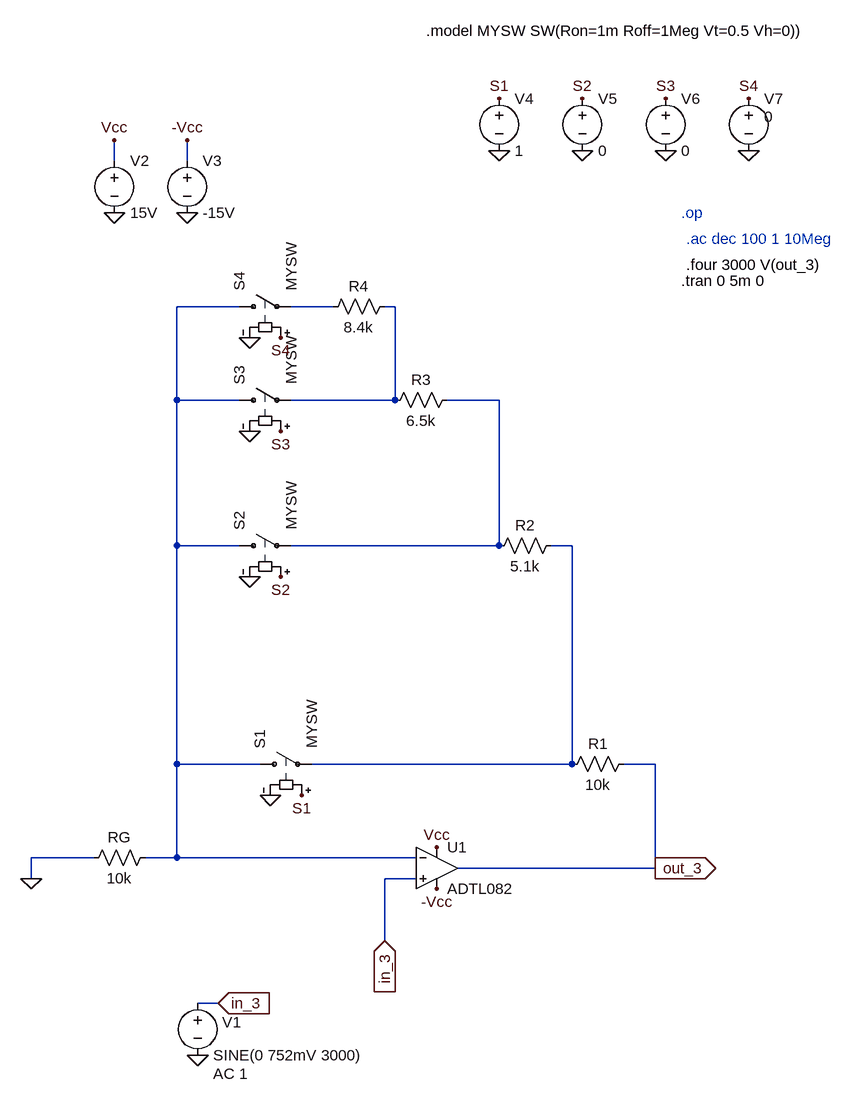
[diagram p0: schematic etaj3.asc]
etaj3.asc, the LTspice schematic file:
Version 4
SHEET 1 1004 1260
WIRE -544 -160 -544 -192
WIRE -432 -160 -432 -192
WIRE -352 64 -448 64
WIRE -208 64 -272 64
WIRE -112 64 -128 64
WIRE -448 208 -448 64
WIRE -352 208 -448 208
WIRE -112 208 -112 64
WIRE -112 208 -272 208
WIRE 48 208 -32 208
WIRE -448 432 -448 208
WIRE -352 432 -448 432
WIRE 48 432 48 208
WIRE 48 432 -272 432
WIRE 160 432 128 432
WIRE -448 768 -448 432
WIRE -320 768 -448 768
WIRE 160 768 160 432
WIRE 160 768 -240 768
WIRE 288 768 240 768
WIRE -576 912 -672 912
WIRE -448 912 -448 768
WIRE -448 912 -496 912
WIRE -80 912 -448 912
WIRE 288 928 288 768
WIRE 288 928 -16 928
WIRE -672 944 -672 912
WIRE -80 944 -128 944
WIRE -128 1040 -128 944
WIRE -384 1136 -416 1136
FLAG -432 -80 0
FLAG -544 -80 0
FLAG -544 -192 Vcc
FLAG -432 -192 -Vcc
FLAG -48 896 Vcc
FLAG -48 960 -Vcc
FLAG -672 944 0
FLAG -416 1216 0
FLAG 48 -176 0
FLAG 48 -256 S1
FLAG 176 -176 0
FLAG 176 -256 S2
FLAG 304 -176 0
FLAG 304 -256 S3
FLAG 432 -176 0
FLAG 432 -256 S4
FLAG -304 816 0
FLAG -336 480 0
FLAG -336 256 0
FLAG -336 112 0
FLAG -288 112 S4
FLAG -288 256 S3
FLAG -288 480 S2
FLAG -256 816 S1
FLAG 288 928 out_3
IOPIN 288 928 Out
FLAG -128 1040 in_3
IOPIN -128 1040 In
FLAG -384 1136 in_3
IOPIN -384 1136 In
SYMBOL voltage -416 1120 R0
WINDOW 0 38 45 Left 2
WINDOW 123 24 124 Left 2
WINDOW 39 0 0 Left 0
SYMATTR InstName V1
SYMATTR Value2 AC 1
SYMATTR Value SINE(0 752mV 3000)
SYMBOL OpAmps\\ADTL082 -48 864 R0
SYMATTR InstName U1
SYMBOL voltage -544 -176 R0
WINDOW 123 0 0 Left 2
WINDOW 39 0 0 Left 2
SYMATTR InstName V2
SYMATTR Value 15V
SYMBOL voltage -432 -176 R0
WINDOW 123 0 0 Left 2
WINDOW 39 0 0 Left 2
SYMATTR InstName V3
SYMATTR Value -15V
SYMBOL res -480 896 R90
WINDOW 0 0 56 VBottom 2
WINDOW 3 32 56 VTop 2
SYMATTR InstName RG
SYMATTR Value 10k
SYMBOL res 256 752 R90
WINDOW 0 0 56 VBottom 2
WINDOW 3 32 56 VTop 2
SYMATTR InstName R1
SYMATTR Value 10k
SYMBOL res 144 416 R90
WINDOW 0 0 56 VBottom 2
WINDOW 3 32 56 VTop 2
SYMATTR InstName R2
SYMATTR Value 5.1k
SYMBOL res -16 192 R90
WINDOW 0 0 56 VBottom 2
WINDOW 3 32 56 VTop 2
SYMATTR InstName R3
SYMATTR Value 6.5k
SYMBOL res -112 48 R90
WINDOW 0 0 56 VBottom 2
WINDOW 3 32 56 VTop 2
SYMATTR InstName R4
SYMATTR Value 8.4k
SYMBOL voltage 48 -272 R0
WINDOW 123 0 0 Left 0
WINDOW 39 0 0 Left 0
SYMATTR InstName V4
SYMATTR Value 1
SYMBOL voltage 176 -272 R0
WINDOW 123 0 0 Left 0
WINDOW 39 0 0 Left 0
SYMATTR InstName V5
SYMATTR Value 0
SYMBOL voltage 304 -272 R0
WINDOW 123 0 0 Left 0
WINDOW 39 0 0 Left 0
SYMATTR InstName V6
SYMATTR Value 0
SYMBOL voltage 432 -272 R0
WINDOW 123 0 0 Left 0
WINDOW 39 0 0 Left 0
WINDOW 3 24 44 Left 2
SYMATTR InstName V7
SYMATTR Value 0
SYMBOL sw -336 768 R270
SYMATTR InstName S1
SYMATTR Value MYSW
SYMBOL sw -368 432 R270
SYMATTR InstName S2
SYMATTR Value MYSW
SYMBOL sw -368 208 R270
SYMATTR InstName S3
SYMATTR Value MYSW
SYMBOL sw -368 64 R270
SYMATTR InstName S4
SYMATTR Value MYSW
TEXT 328 -80 Left 2 ;.op
TEXT 336 -40 Left 2 ;.ac dec 100 1 10Meg
TEXT -64 -360 Left 2 !.model MYSW SW(Ron=1m Roff=1Meg Vt=0.5 Vh=0))
TEXT 336 0 Left 2 !.four 3000 V(out_3)
TEXT 328 24 Left 2 !.tran 0 5m 0

The netlist it stands for:
* etaj3.asc
V1 in_3 0 SINE(0 752mV 3000) AC 1
XU1 in_3 N001 Vcc -Vcc out_3 ADTL082  ; pins In+ In- V+ V- OUT
V2 Vcc 0 15V
V3 -Vcc 0 -15V
RG N001 0 10k
R1 out_3 N005 10k
R2 N005 N004 5.1k
R3 N004 N003 6.5k
R4 N003 N002 8.4k
V4 S1 0 1
V5 S2 0 0
V6 S3 0 0
V7 S4 0 0
S1 N001 N005 S1 0 MYSW
S2 N001 N004 S2 0 MYSW
S3 N001 N003 S3 0 MYSW
S4 N001 N002 S4 0 MYSW
* .op
* .ac dec 100 1 10Meg
.model MYSW SW(Ron=1m Roff=1Meg Vt=0.5 Vh=0))
.four 3000 V(out_3)
.tran 0 5m 0
.lib ADI.lib
.backanno
.end

* Results of the author's LTspice run, read from the files saved beside the schematic
* Operating Point, zero values left out:
*   V(vcc) = 15 V
*   V(out_3) = 20 nV
*   V(-vcc) = -15 V
*   V(s1) = 1 V
*   I(R1) = 2 pA
*   I(S1) = 2 pA
*   I(V1) = -2 pA
*   I(V2) = -5.124 mA
*   I(V3) = 5.124 mA
*   Ix(u1:1) = 2 pA
*   Ix(u1:2) = 2 pA
*   Ix(u1:3) = 5.124 mA
*   Ix(u1:4) = -5.124 mA
*   Ix(u1:5) = -2 pA
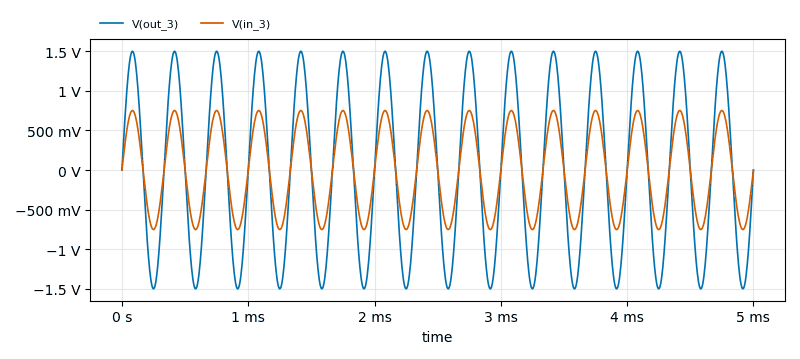
[diagram p1: Transient Analysis of etaj3.asc, plotted from the saved traces]
* Transient Analysis, 1 run:
*   V(out_3): min -1.501 V, max 1.501 V, average 276.4 nV, rms 1.061 V, last -1.138 mV
*   V(in_3): min -752 mV, max 752 mV, average 0 V, rms 531.8 mV, last 0 V
* From the log:
*   N-Period=1
*   Fourier components of V(out_3)
*   DC component:-1.39614e-08
*   Harmonic  Frequency   Fourier   Normalized   Phase    Normalized
*    Number     [Hz]     Component   Component  [degree]  Phase [deg]
*       1      3.000e+3   1.500e+0   1.000e+0     90.04°      0.00°
*       2      6.000e+3   7.523e-8   5.016e-8    159.65°     69.61°
*       3      9.000e+3   8.570e-8   5.715e-8    150.50°     60.46°
*       4      1.200e+4   9.174e-8   6.117e-8    139.26°     49.22°
*       5      1.500e+4   9.045e-8   6.031e-8    140.37°     50.32°
*       6      1.800e+4   1.004e-7   6.692e-8    127.23°     37.19°
*       7      2.100e+4   1.135e-7   7.569e-8    119.74°     29.70°
*       8      2.400e+4   1.271e-7   8.474e-8    120.25°     30.21°
*       9      2.700e+4   1.387e-7   9.248e-8    117.55°     27.50°
*   Partial Harmonic Distortion: 0.000020%
*   Total Harmonic Distortion:   0.030206%